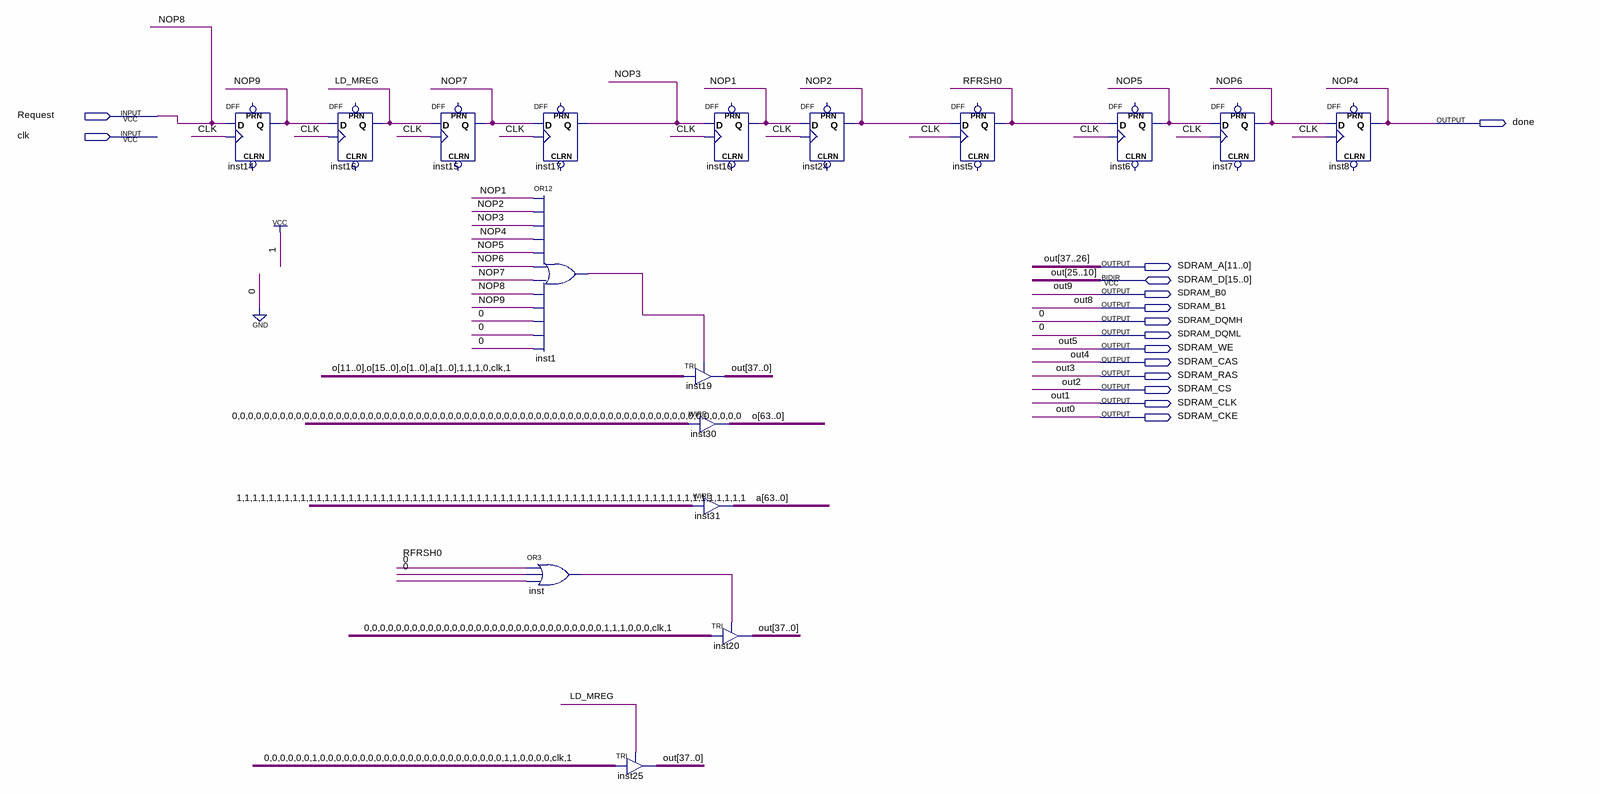
[diagram p0: schematic sheet]
// Quartus schematic SDRAMRefresh.bdf as structural Verilog: 17 symbols, 15 pins
module SDRAMRefresh (
  input  Request,
  input  clk,
  inout  [15:0] SDRAM_D,
  output done,
  output [11:0] SDRAM_A,
  output SDRAM_B0,
  output SDRAM_B1,
  output SDRAM_DQMH,
  output SDRAM_DQML,
  output SDRAM_WE,
  output SDRAM_CAS,
  output SDRAM_RAS,
  output SDRAM_CS,
  output SDRAM_CLK,
  output SDRAM_CKE
);

  wire inst1_out, inst_out, LD_MREG, NOP1, NOP2, NOP3, NOP5, NOP6, NOP7, NOP9, RFRSH0;
  wire [7:6] out;
  wire [63:0] a, o;

  DFF inst14 (.CLK(clk), .D(Request), .Q(NOP9));  // open: CLRN, PRN
  DFF inst16 (.CLK(clk), .D(NOP9), .Q(LD_MREG));  // open: CLRN, PRN
  DFF inst15 (.CLK(clk), .D(LD_MREG), .Q(NOP7));  // open: CLRN, PRN
  DFF inst17 (.CLK(clk), .D(NOP7), .Q(NOP3));  // open: CLRN, PRN
  or inst1 (inst1_out, NOP1, NOP2, NOP3, done, NOP5, NOP6, NOP7, Request, NOP9, 1'b0, 1'b0, 1'b0);
  or inst (inst_out, RFRSH0, 1'b0, 1'b0);
  TRI inst25[37:0] (
    .IN({36'b000000100000000000000000000000110000, clk, 1'b1}), .OE(LD_MREG),
    .OUT({SDRAM_A, SDRAM_D, SDRAM_B0, SDRAM_B1, out, SDRAM_WE, SDRAM_CAS, SDRAM_RAS, SDRAM_CS, SDRAM_CLK, SDRAM_CKE}));
  DFF inst10 (.CLK(clk), .D(NOP3), .Q(NOP1));  // open: CLRN, PRN
  TRI inst19[37:0] (
    .IN({o[11:0], o[15:0], o[1:0], a[1:0], 4'b1110, clk, 1'b1}), .OE(inst1_out),
    .OUT({SDRAM_A, SDRAM_D, SDRAM_B0, SDRAM_B1, out, SDRAM_WE, SDRAM_CAS, SDRAM_RAS, SDRAM_CS, SDRAM_CLK, SDRAM_CKE}));
  assign o = {64{1'b0}};  // WIRE inst30
  assign a = {64{1'b1}};  // WIRE inst31
  TRI inst20[37:0] (
    .IN({36'b000000000000000000000000000000111000, clk, 1'b1}), .OE(inst_out),
    .OUT({SDRAM_A, SDRAM_D, SDRAM_B0, SDRAM_B1, out, SDRAM_WE, SDRAM_CAS, SDRAM_RAS, SDRAM_CS, SDRAM_CLK, SDRAM_CKE}));
  DFF inst24 (.CLK(clk), .D(NOP1), .Q(NOP2));  // open: CLRN, PRN
  DFF inst5 (.CLK(clk), .D(NOP2), .Q(RFRSH0));  // open: CLRN, PRN
  DFF inst6 (.CLK(clk), .D(RFRSH0), .Q(NOP5));  // open: CLRN, PRN
  DFF inst7 (.CLK(clk), .D(NOP5), .Q(NOP6));  // open: CLRN, PRN
  DFF inst8 (.CLK(clk), .D(NOP6), .Q(done));  // open: CLRN, PRN

  assign SDRAM_DQMH = 1'b0;
  assign SDRAM_DQML = 1'b0;

  // Other names for the same wires on the sheet: NOP4 = done; NOP8 = Request;
  //   out (some bits) = {SDRAM_A, SDRAM_D, SDRAM_B0, SDRAM_B1, SDRAM_WE, SDRAM_CAS, SDRAM_RAS, SDRAM_CS, SDRAM_CLK, SDRAM_CKE};
  //   out0 = SDRAM_CKE; out1 = SDRAM_CLK; out2 = SDRAM_CS; out3 = SDRAM_RAS; out4 = SDRAM_CAS; out5 = SDRAM_WE;
  //   out8 = SDRAM_B1; out9 = SDRAM_B0
endmodule
